# Altium schematic sheet CH32H416RDU6-R0.SchDoc
size 457 x 287 mm; SheetNumber: 0; SheetTotal: 0
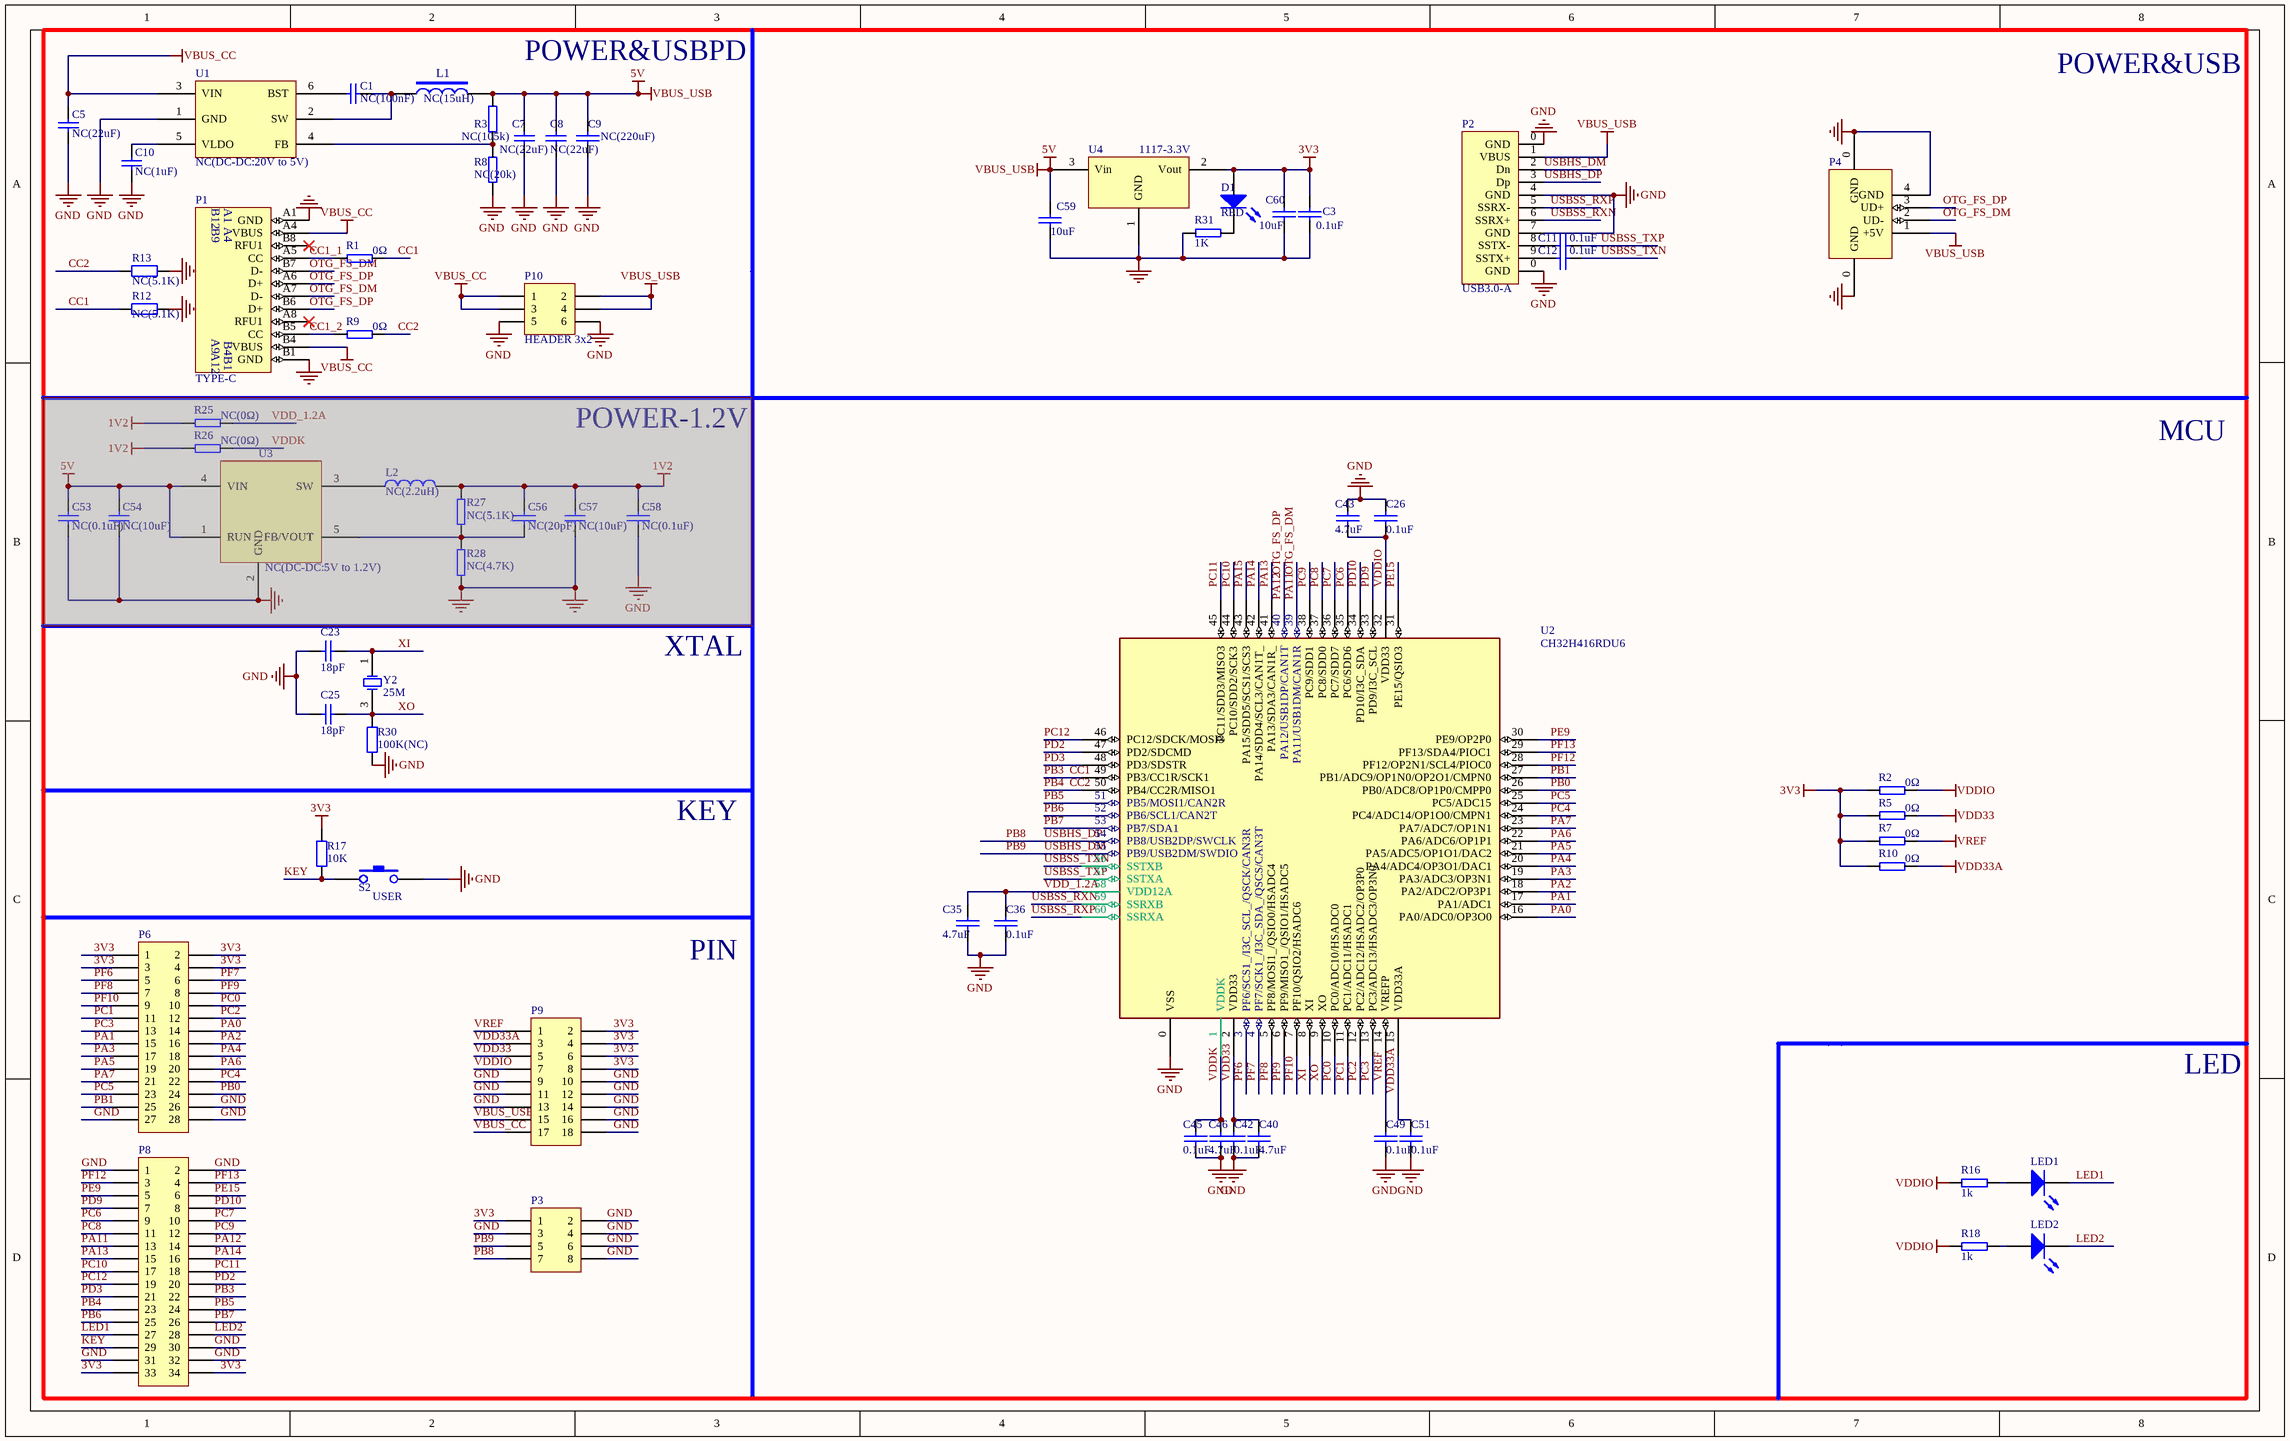
[diagram p0: CH32H416RDU6-R0.SchDoc]

## Parts
C1  NC(100nF)  [0402_C]
C3  0.1uF  [0402_C]
C5  NC(22uF)  [0805_C]
C7  NC(22uF)  [0805_C]
C8  NC(22uF)  [0805_C]
C9  NC(220uF)  [CD0.1]
C10  NC(1uF)  [0402_C]
C11  0.1uF  [0402_C]
C12  0.1uF  [0402_C]
C23  18pF  [0402_C]
C25  18pF  [0402_C]
C26  0.1uF  [0402_C]
C35  4.7uF  [0402_C]
C36  0.1uF  [0402_C]
C40  4.7uF  [0402_C]
C42  0.1uF  [0402_C]
C43  4.7uF  [0402_C]
C45  0.1uF  [0402_C]
C46  4.7uF  [0402_C]
C49  0.1uF  [0402_C]
C51  0.1uF  [0402_C]
C53  NC(0.1uF)  [0402_C]  (masked out: inside a compile mask, not in the netlist)
C54  NC(10uF)  [0603_C]  (masked out: inside a compile mask, not in the netlist)
C56  NC(20pF)  [0402_C]  (masked out: inside a compile mask, not in the netlist)
C57  NC(10uF)  [0603_C]  (masked out: inside a compile mask, not in the netlist)
C58  NC(0.1uF)  [0402_C]  (masked out: inside a compile mask, not in the netlist)
C59  10uF  [0603_C]
C60  10uF  [0603_C]
D1  RED  [0603+]
L1  NC(15uH)  [SMD_6x6mm]
L2  NC(2.2uH)  [CD32]  (masked out: inside a compile mask, not in the netlist)
LED1  LED2  blue  [0603+]  (value not drawn)
LED2  LED1   blue  [0603+]  (value not drawn)
P1  TYPE-C  [TYPE-C-Receptacle-2.0]
P2  USB3.0-A  [USB3.0-A-Receptacle]
P3  HEADER 4x2  [IDC8-2.54mm]  (value not drawn)
P4  USB_A  [USBAF]  (value not drawn)
P6  HEADER 14x2  [IDC28-2.54MM]  (value not drawn)
P8  HEADER 17x2  [IDC34-2.54MM]  (value not drawn)
P9  HEADER 9x2  [IDC18-2.54MM]  (value not drawn)
P10  HEADER 3x2  [IDC6-2.54mm]
R1  0Ω  [0402]
R2  0Ω  [0402]
R3  NC(105k)  [0402]
R5  0Ω  [0402]
R7  0Ω  [0402]
R8  NC(20k)  [0402]
R9  0Ω  [0402]
R10  0Ω  [0402]
R12  NC(5.1K)  [0402]
R13  NC(5.1K)  [0402]
R16  1k  [0402]
R17  10K  [0402]
R18  1k  [0402]
R25  NC(0Ω)  [0402]  (masked out: inside a compile mask, not in the netlist)
R26  NC(0Ω)  [0402]  (masked out: inside a compile mask, not in the netlist)
R27  NC(5.1K)  [0402]  (masked out: inside a compile mask, not in the netlist)
R28  NC(4.7K)  [0402]  (masked out: inside a compile mask, not in the netlist)
R30  100K(NC)  [0402]
R31  1K  [0402]
S2  USER  [SMD_6.1x3.65x2.5mm-KEY]
U1  NC(DC-DC:20V to 5V)
U2  CH32H416RDU6  [QFN60_6X6]
U3  NC(DC-DC:5V to 1.2V)  (masked out: inside a compile mask, not in the netlist)
U4  1117-3.3V  [SOT-223]
Y2  25M  [XT3225]

## Nets
3V3: C3.1 C60.1 D1.1(A) P3.1 P6.1 P6.2 P6.3 P6.4 P8.33 P8.34 P9.2 P9.4 P9.6 P9.8 R2.2 R5.2 R7.2 R10.2 R17.1 U4.2(Vout)
GND: C3.2 C5.1 C7.1 C8.1 C9.2 C10.1 C23.1 C25.1 C26.2 C35.1 C36.1 C40.1 C42.1 C43.1 C45.1 C46.2 C49.1 C51.1 C59.2 C60.2 P1.A1(GND) P1.B1(GND) P2.0(GND) P2.4(GND) P2.7(GND) P3.2 P3.3 P3.4 P3.6 P3.8 P4.0(GND) P4.4(GND) P6.26 P6.27 P6.28 P8.1 P8.2 P8.30 P8.31 P8.32 P9.9 P9.10 P9.11 P9.12 P9.13 P9.14 P9.16 P9.18 P10.5 P10.6 R8.1 R12.2 R13.2 R30.1 R31.1 S2.2 U1.1(GND) U2.0(VSS) U4.1(GND)
VBUS_CC: C5.2 P1.A4(VBUS) P1.B4(VBUS) P9.17 P10.1 P10.3 U1.3(VIN)
VBUS_USB: C7.2 C8.2 C9.1 C59.1 L1.2 P2.1(VBUS) P4.1(+5V) P9.15 P10.2 P10.4 R3.2 U4.3(Vin)  [also labelled 5V]
VDD33: C40.2 C42.2 P9.5 R5.1 U2.2(VDD33)
VDD33A: C51.2 P9.3 R10.1 U2.15(VDD33A)
VDDIO: C26.1 C43.2 P9.7 R2.1 R16.1 R18.1 U2.32(VDD33)
VREF: C49.2 P9.1 R7.1 U2.14(VREFP)
CC1: P8.22 R1.1 R12.1 U2.49(PB3/CC1R/SCK1)  [also labelled PB3]
CC1_1: P1.A5(CC) R1.2
CC1_2: P1.B5(CC) R9.2
CC2: P8.23 R9.1 R13.1 U2.50(PB4/CC2R/MISO1)  [also labelled PB4]
KEY: P8.29 R17.2 S2.1
LED1: LED1.2(K) P8.27
LED2: LED2.2(K) P8.28
OTG_FS_DM: P1.A7(D-) P1.B7(D-) P4.2(UD-) P8.13 U2.39(PA11/USB1DM/CAN1R)  [also labelled PA11]
OTG_FS_DP: P1.A6(D+) P1.B6(D+) P4.3(UD+) P8.14 U2.40(PA12/USB1DP/CAN1T)  [also labelled PA12]
PA0: P6.14 U2.16(PA0/ADC0/OP3O0)
PA1: P6.15 U2.17(PA1/ADC1)
PA2: P6.16 U2.18(PA2/ADC2/OP3P1)
PA3: P6.17 U2.19(PA3/ADC3/OP3N1)
PA4: P6.18 U2.20(PA4/ADC4/OP3O1/DAC1)
PA5: P6.19 U2.21(PA5/ADC5/OP1O1/DAC2)
PA6: P6.20 U2.22(PA6/ADC6/OP1P1)
PA7: P6.21 U2.23(PA7/ADC7/OP1N1)
PA13: P8.15 U2.41(PA13/SDA3/CAN1R_)
PA14: P8.16 U2.42(PA14/SDD4/SCL3/CAN1T_)
PA15: U2.43(PA15/SDD5/SCS1/SCS3)
PB0: P6.24 U2.26(PB0/ADC8/OP1P0/CMPP0)
PB1: P6.25 U2.27(PB1/ADC9/OP1N0/OP2O1/CMPN0)
PB5: P8.24 U2.51(PB5/MOSI1/CAN2R)
PB6: P8.25 U2.52(PB6/SCL1/CAN2T)
PB7: P8.26 U2.53(PB7/SDA1)
PB8: P2.3(Dp) P3.7 U2.54(PB8/USB2DP/SWCLK)  [also labelled USBHS_DP]
PB9: P2.2(Dn) P3.5 U2.55(PB9/USB2DM/SWDIO)  [also labelled USBHS_DM]
PC0: P6.10 U2.10(PC0/ADC10/HSADC0)
PC1: P6.11 U2.11(PC1/ADC11/HSADC1)
PC2: P6.12 U2.12(PC2/ADC12/HSADC2/OP3P0)
PC3: P6.13 U2.13(PC3/ADC13/HSADC3/OP3N0)
PC4: P6.22 U2.24(PC4/ADC14/OP1O0/CMPN1)
PC5: P6.23 U2.25(PC5/ADC15)
PC6: P8.9 U2.35(PC6/SDD6)
PC7: P8.10 U2.36(PC7/SDD7)
PC8: P8.11 U2.37(PC8/SDD0)
PC9: P8.12 U2.38(PC9/SDD1)
PC10: P8.17 U2.44(PC10/SDD2/SCK3)
PC11: P8.18 U2.45(PC11/SDD3/MISO3)
PC12: P8.19 U2.46(PC12/SDCK/MOSI3)
PD2: P8.20 U2.47(PD2/SDCMD)
PD3: P8.21 U2.48(PD3/SDSTR)
PD9: P8.7 U2.33(PD9/I3C_SCL)
PD10: P8.8 U2.34(PD10/I3C_SDA)
PE9: P8.5 U2.30(PE9/OP2P0)
PE15: P8.6 U2.31(PE15/QSIO3)
PF6: P6.5 U2.3(PF6/SCS1_/I3C_SCL_/QSCK/CAN3R)
PF7: P6.6 U2.4(PF7/SCK1_/I3C_SDA_/QSCS/CAN3T)
PF8: P6.7 U2.5(PF8/MOSI1_/QSIO0/HSADC4)
PF9: P6.8 U2.6(PF9/MISO1_/QSIO1/HSADC5)
PF10: P6.9 U2.7(PF10/QSIO2/HSADC6)
PF12: P8.3 U2.28(PF12/OP2N1/SCL4/PIOC0)
PF13: P8.4 U2.29(PF13/SDA4/PIOC1)
USBSS_RXN: P2.6(SSRX+) U2.59(SSRXB)
USBSS_RXP: P2.5(SSRX-) U2.60(SSRXA)
USBSS_TXN: C12.2 U2.56(SSTXB)
USBSS_TXP: C11.2 U2.57(SSTXA)
VDD_1.2A: C35.2 C36.2 U2.58(VDD12A)
VDDK: C45.2 C46.1 U2.1(VDDK)
XI: C23.2 U2.8(XI) Y2.1(OSC1)
XO: C25.2 R30.2 U2.9(XO) Y2.3(OSC2)
NetC1_1: C1.1 L1.1 U1.2(SW)
NetC1_2: C1.2 U1.6(BST)
NetC10_2: C10.2 U1.5(VLDO)
NetC11_1: C11.1 P2.8(SSTX-)
NetC12_1: C12.1 P2.9(SSTX+)
NetD1_2: D1.2(K) R31.2
NetLED1_1: LED1.1(A) R16.2
NetLED2_1: LED2.1(A) R18.2
NetR3_1: R3.1 R8.2 U1.4(FB)

Not connected (* = marked no-connect by the designer): P1 A8(RFU1)* B8(RFU1)*

## Notes on the sheet
- POWER&USBPD
- POWER&USB
- POWER-1.2V
- MCU
- (near U3) Hot!!!
- XTAL
- KEY
- PIN
- LED
- Title
- Size:
- Date:
- A3
- Number:
- Time:
- Revision:
- Sheet
- of
- File:
- (in symbol TYPE-C1) B12; B9; A9; A12

## Library data of the parts
C1 C5 C7 C8 C10 = 0603 100nF (104) 10% 50V: 贴片电容; ComponentLink1Description: 供应商链接; ComponentLink1URL: http://www.szlcsc.com/product/details_15331.html; Package: 0603; Supplier: LC; SuppliersPartNumber: C14663
C3 C9 C11 C12 C26 C35 C36 C40 C42 C43 C45 C46 C49 C51 C56 C58-C60 = CAP: Capacitor
C23 C25 C53 C54 C57 = Cap: Capacitor
  C53 C54 C57: Published: 8-Jun-2000; LatestRevisionDate: 17-Jul-2002; LatestRevisionNote: Re-released for DXP Platform.; PackageReference: RAD-0.3; Publisher: Altium Limited; PackageDescription: Radial Cap, Thru-Hole; 2 Leads; 0.3 in Pin Spacing
D1 LED1 LED2 = LED0: Typical INFRARED GaAs LED; Published: 8-Jun-2000; LatestRevisionDate: 08-Jul-2005; LatestRevisionNote: Mech Layer 1 removed.; PackageReference: LED-0; Publisher: Altium Limited
  D1: PackageDescription: LED; 2 Leads
L1 L2 = INDUCTOR
P1 = TYPE-C1
P3 = HEADER 4x2: Header, 4-Pin, Dual row
P4 = USB: USB Port
P6 = HEADER 14x2: Header, 14-Pin, Dual row
P8 = HEADER 17x2: Header, 17-Pin, Dual row
P9 = HEADER 9x2: Header, 9-Pin, Dual row
P10 = HEADER 3x2: Header, 3-Pin, Dual row
R1-R3 R5 R7-R10 R16 R18 R25 R26 R31 = RES
R12 R13 R17 R30 = Res2: Resistor
R27 R28 = R
S2 = KEY1
U1 = TPS54202: DCDC
U2 = CH32H416RDU6: RISC-V FPU HD-MCU, 400MHz, USB3.0 & PD, SDMMC, QSPI, OPA, ADC, DAC
U3 = FP6160
Y2 = XTAL: Crystal Oscillator; Published: 8-Jun-2000; LatestRevisionDate: 17-Jul-2002; LatestRevisionNote: Re-released for DXP Platform.; PackageReference: R38; Publisher: Altium Limited